# EAGLE design mic-input (EAGLE 8.0.2)
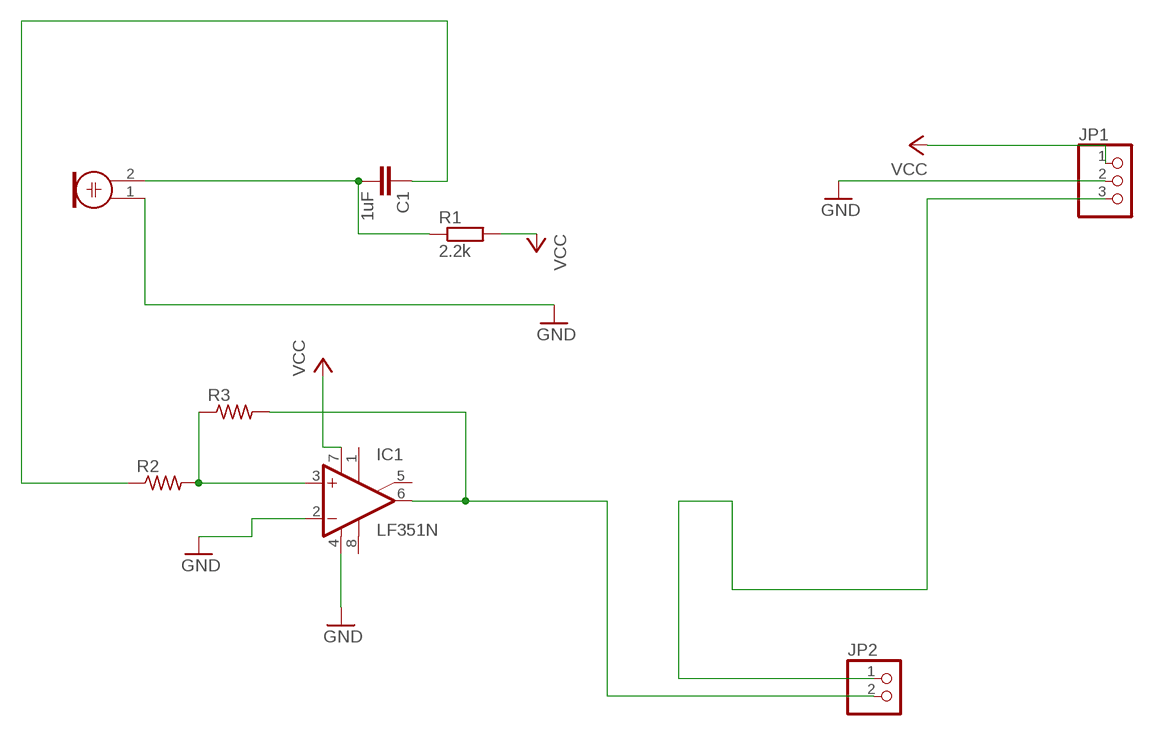
[diagram p0: schematic, sheet 1]

## Parts
C1  1uF  C2,5-3  [C2.5-3]
IC1  LF351N  [DIL08]
JP1  PINHD-1X3  [1X03]
JP2  PINHD-1X2  [1X02]
M1  ELECTRET_MICROPHON-F6050AP  [F6050AP]
R1  2.2k  R-EU_0204/7  [0204/7]
R2  R-US_0204/7  [0204/7]
R3  R-US_0204/7  [0204/7]

## Nets
GND: IC1.2(-IN) IC1.4(V-) JP1.2 M1.1
N$1: C1.2 M1.2 R1.1
N$2: C1.1 R2.1
N$3: IC1.3(+IN) R2.2 R3.1
N$4: IC1.6(OUT) JP2.2 R3.2
N$5: JP1.3 JP2.1
VCC: IC1.7(V+) JP1.1 R1.2
Unconnected: IC1.1(ON1) IC1.5(ON2) IC1.8(OPT)

## Library data of the parts
C1 = capacitor-wima:C: CAPACITOR naming: grid - package width
IC1 = linear:LF351: OP AMP
JP1 = pinhead:PINHD-1X3: PIN HEADER
JP2 = pinhead:PINHD-1X2: PIN HEADER
M1 = microphon:ELECTRET_MICROPHON-: Electret Condenser Microphone
R1 = resistor:R-EU_: RESISTOR, European symbol
R2 R3 = adafruit:R-US_: RESISTOR, American symbol

## Board
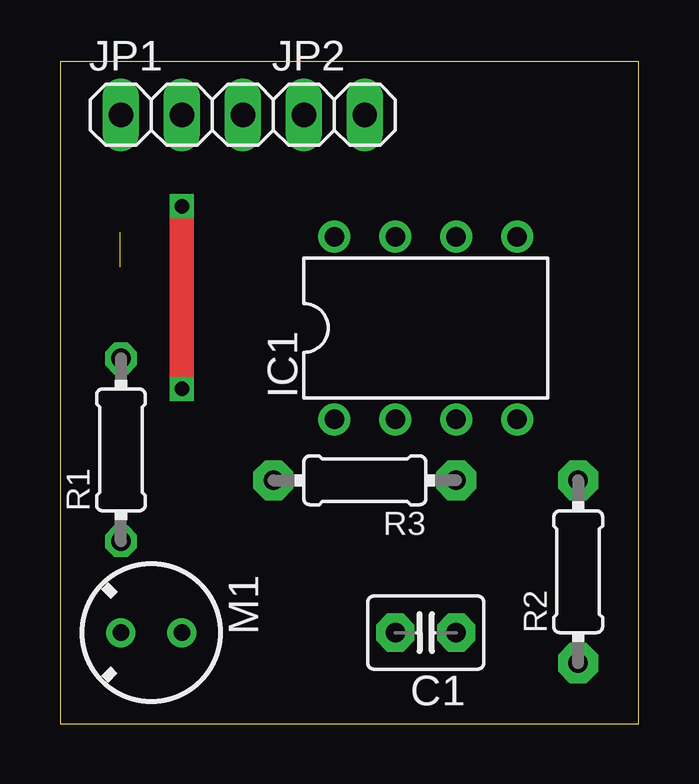
[diagram p1: board, top side]
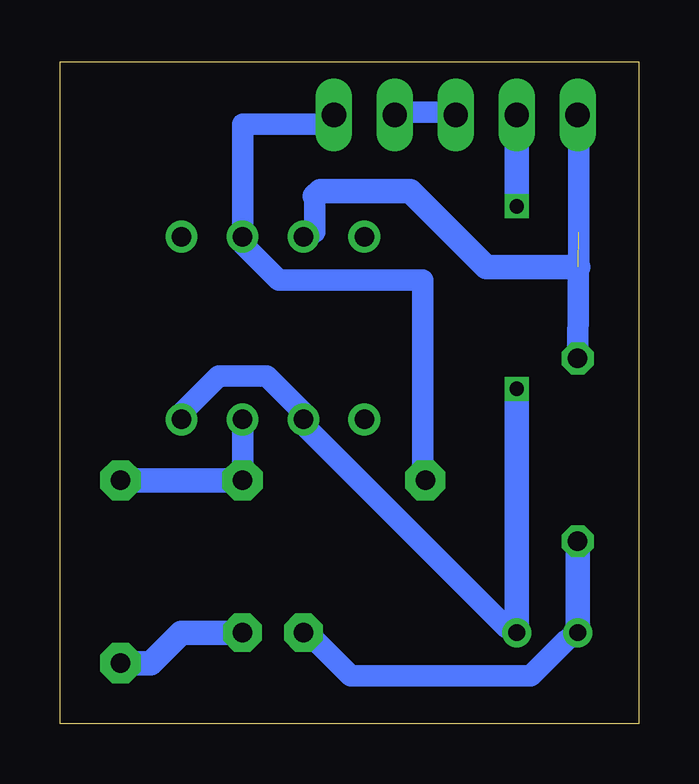
[diagram p2: board, bottom side, seen from below]

Size 24.11 x 27.61 mm. Coordinates in mm from the lower left corner, seen from the top.
Outline: 0,0 24.11,0 24.11,27.61 0,27.61 0,0
Copper layers (1*16): Top 0.035mm / dielectric 1.5mm / Bottom 0.035mm
Design rules "default *": minimum track width 0.9mm, minimum drill 24mil, track to track 0.5mm, track to pad 0.5mm, pad to pad 8mil, via to via 8mil, smd to smd 8mil, copper to edge 40mil, drill to drill 8mil, minimum pad ring 10mil, minimum via ring 8mil, stop-mask expansion 4mil, vias tented up to drill 0mil, thermal gap 10mil

### Footprints (pad centres in the part's own frame; a part is rotated, then mirrored left to right if it is on the bottom)
C2.5-3 = drill 0.813 pad 1.6 octagon: 1 -1.27,0; 2 1.27,0
DIL08 = drill 0.813 pad 1.27: 1 -3.81,-3.81; 2 -1.27,-3.81; 3 1.27,-3.81; 4 3.81,-3.81; 5 3.81,3.81; 6 1.27,3.81; 7 -1.27,3.81; 8 -3.81,3.81
1X03 = drill 1.016 long: 1 -2.54,0; 2 0,0; 3 2.54,0
1X02 = drill 1.016 long: 1 -1.27,0; 2 1.27,0
F6050AP = drill 0.7 pad 1.2: 1 0,1.27; 2 0,-1.27
0204/7 = drill 0.813 octagon: 1 -3.81,0; 2 3.81,0
0204/7' = drill 0.813 pad 1.676 octagon: 1 -3.81,0; 2 3.81,0

### Placement (x,y rotation side)
C1  15.24,3.81 180 top
IC1  15.24,16.51 0 top
JP1  5.08,25.4 0 top
JP2  11.43,25.4 0 top
M1  3.81,3.81 270 top
R1  2.54,11.43 90 top
R2  [0204/7']  21.59,6.35 90 top
R3  [0204/7']  12.7,10.16 180 top

### Tracks (layer width: path | path; a pad name or v marks a point on that pad's centre or on a via)
GND  (via drill 0.6)
  Top 1.016: v5.08,21.59 v5.08,13.97
  Bottom 0.9: M1.1 5.5,4 14,12.5 IC1.2 14,13 15.5,14.5 17.5,14.5 19,13 IC1.4
  Bottom 1.016: JP1.2 v5.08,21.59 | v5.08,13.97 M1.1
N$1
  Bottom 0.9: C1.2 13.5,3.5 12,2 4.5,2 3,3.5 M1.2
  Bottom 1.016: R1.1 M1.2
N$2
  Bottom 1.016: R2.1 20.32,2.54 19.05,3.81 C1.1
N$3
  Bottom 0.9: IC1.3 16.5,12.5 16.5,10.5 R3.1
  Bottom 1.016: R2.2 R3.1
N$4
  Bottom 0.9: JP2.2 13,25 16.5,25 16.5,20.5 IC1.6 16.5,20 15,18.5 9,18.5 9,10.5 R3.2
N$5
  Bottom 0.9: JP1.3 8,25.5 10,25.5 JP2.1
VCC  (1 unrouted)
  Bottom 0.9: R1.2 2.5,20.5 2.5,25 JP1.1 | 13.5,22 13.5,20.5 IC1.7
  Bottom 1.016: 2.51,19.05 6.35,19.05 | 6.35,19.05 | 6.35,19.05 | 6.35,19.05 9.53,22.23 13.28,22.23 13.5,22